# Altium schematic sheet SchematicArduinoUno.SchDoc: Basic Training
size A; DrawnBy: Carlos Berlin; Revision: Ver 1; SheetNumber: 2; SheetTotal: 2
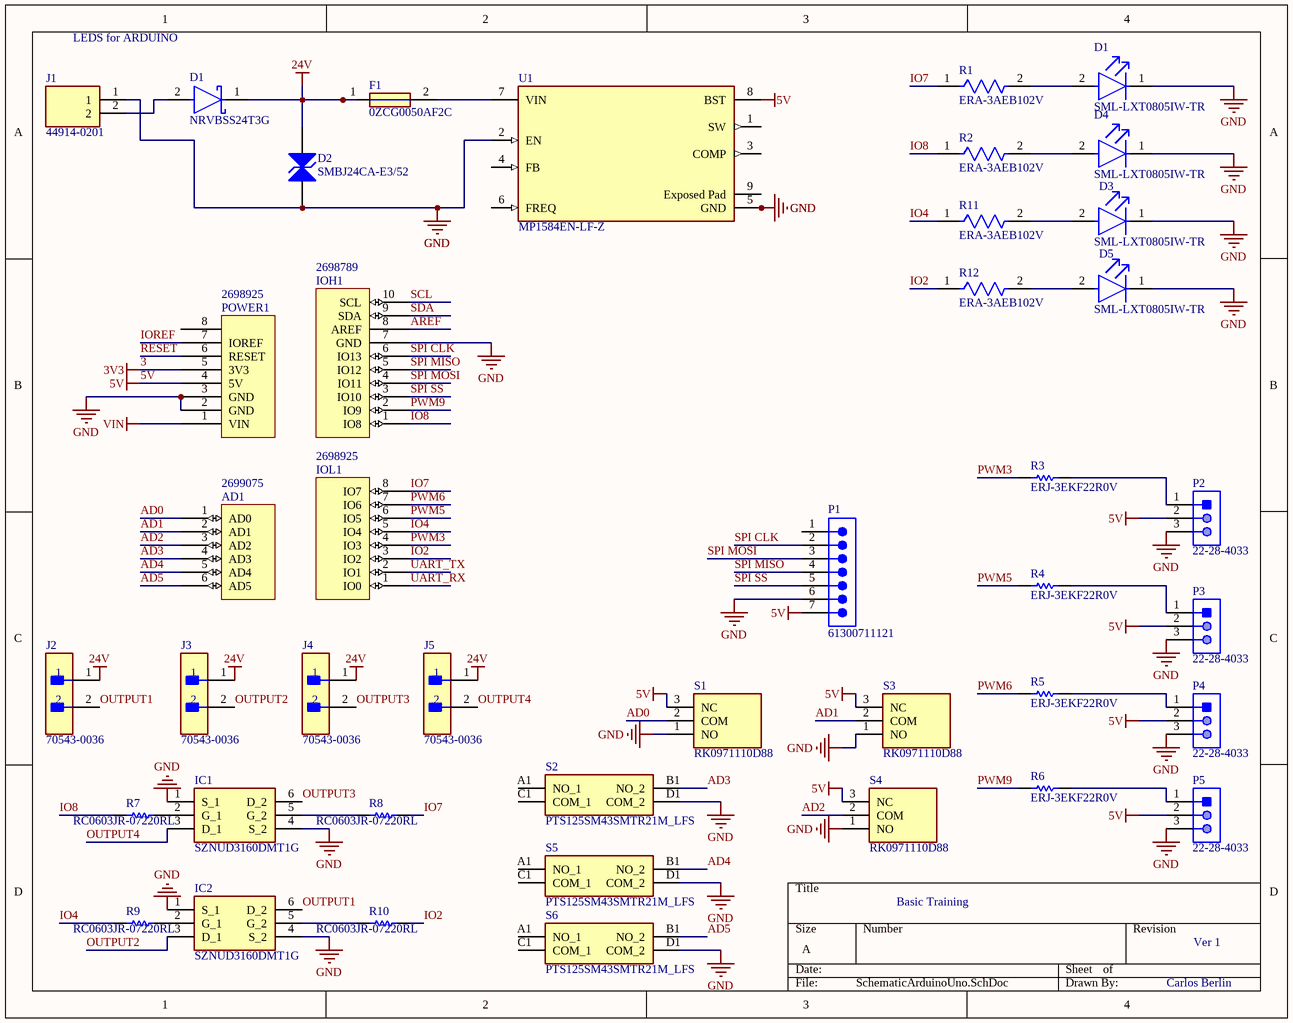
[diagram p0: SchematicArduinoUno.SchDoc]

## Parts
(Parts that share a designator on the sheet are numbered #1, #2 ... from top to bottom, then left to right.)
AD1  Supplier Part Number 4: 2699075  [Header 6x1 8.5mm]  (hidden comment: AD)
D1#1  SML-LXT0805IW-TR  [FP-SML-LXT0805IW-TR-MFG]
D1#2  NRVBSS24T3G  [FP-403A-03-MFG]
D2  SMBJ24CA-E3/52  [VISH-DO-214AA-A-2_V]
D3  SML-LXT0805IW-TR  [FP-SML-LXT0805IW-TR-MFG]
D4  SML-LXT0805IW-TR  [FP-SML-LXT0805IW-TR-MFG]
D5  SML-LXT0805IW-TR  [FP-SML-LXT0805IW-TR-MFG]
F1  0ZCG0050AF2C  [FUSC4632X75N]
IC1  SZNUD3160DMT1G  [SOT95P275X110-6N]
IC2  SZNUD3160DMT1G  [SOT95P275X110-6N]
IOH1  Supplier Part Number 3: 2698789  [Header 10x1 8.5mm]  (hidden comment: IOH)
IOL1  Supplier Part Number 4: 2698925  [Header 8x1 8.5mm]  (hidden comment: IOL)
J1  44914-0201  [44914-02YY_010203]
J2  70543-0036  [FP-70543-0036-MFG]
J3  70543-0036  [FP-70543-0036-MFG]
J4  70543-0036  [FP-70543-0036-MFG]
J5  70543-0036  [FP-70543-0036-MFG]
P1  61300711121  [61300711121]
P2  22-28-4033  [MOLX-22-28-4033_V]
P3  22-28-4033  [MOLX-22-28-4033_V]
P4  22-28-4033  [MOLX-22-28-4033_V]
P5  22-28-4033  [MOLX-22-28-4033_V]
POWER1  Supplier Part Number 4: 2698925  [Header 8x1 8.5mm]  (hidden comment: POWER_UNO)
R1  ERA-3AEB102V  [FP-ERA3A-IPC_C]
R2  ERA-3AEB102V  [FP-ERA3A-IPC_C]
R3  ERJ-3EKF22R0V  [RESC1608X55X30LL15T15]
R4  ERJ-3EKF22R0V  [RESC1608X55X30LL15T15]
R5  ERJ-3EKF22R0V  [RESC1608X55X30LL15T15]
R6  ERJ-3EKF22R0V  [RESC1608X55X30LL15T15]
R7  RC0603JR-07220RL  [RESC1608X55X25LL10T15]
R8  RC0603JR-07220RL  [RESC1608X55X25LL10T15]
R9  RC0603JR-07220RL  [RESC1608X55X25LL10T15]
R10  RC0603JR-07220RL  [RESC1608X55X25LL10T15]
R11  ERA-3AEB102V  [FP-ERA3A-IPC_C]
R12  ERA-3AEB102V  [FP-ERA3A-IPC_C]
S1  RK0971110D88  [RK0971110D88]
S2  PTS125SM43SMTR21M_LFS  [PTS125SM43SMTR21MLFS]
S3  RK0971110D88  [RK0971110D88]
S4  RK0971110D88  [RK0971110D88]
S5  PTS125SM43SMTR21M_LFS  [PTS125SM43SMTR21MLFS]
S6  PTS125SM43SMTR21M_LFS  [PTS125SM43SMTR21MLFS]
U1  MP1584EN-LF-Z  [FP-MP1584EN-LF-Z-MFG]

## Nets
3: POWER1.5(3V3)  [also labelled 3V3]
5V: P1.7 P2.2 P3.2 P4.2 P5.2 POWER1.4(5V) S1.3(NC) S3.3(NC) S4.3(NC) U1.8(BST)
24V: D1#2.1(C) D2.2(A) F1.1 J2.1 J3.1 J4.1 J5.1
GND: D1#1.1(C) D2.1(A) D3.1(C) D4.1(C) D5.1(C) IC1.1(S_1) IC1.4(S_2) IC2.1(S_1) IC2.4(S_2) IOH1.7(GND) J1.1 P1.6 P2.3 P3.3 P4.3 P5.3 POWER1.2(GND) POWER1.3(GND) S1.1(NO) S2.D1(COM_2) S3.1(NO) S4.1(NO) S5.D1(COM_2) S6.D1(COM_2) U1.2(EN) U1.5(GND)
VIN: POWER1.1(VIN)
AD0: AD1.1(AD0) S1.2(COM)
AD1: AD1.2(AD1) S3.2(COM)
AD2: AD1.3(AD2) S4.2(COM)
AD3: AD1.4(AD3) S2.B1(NO_2)
AD4: AD1.5(AD4) S5.B1(NO_2)
AD5: AD1.6(AD5) S6.B1(NO_2)
AREF: IOH1.8(AREF)
IO2: IOL1.3(IO2) R10.2 R12.1
IO4: IOL1.5(IO4) R9.1 R11.1
IO7: IOL1.8(IO7) R1.1 R8.2
IO8: IOH1.1(IO8) R2.1 R7.1
IOREF: POWER1.7(IOREF)
OUTPUT1: IC2.6(D_2) J2.2
OUTPUT2: IC2.3(D_1) J3.2
OUTPUT3: IC1.6(D_2) J4.2
OUTPUT4: IC1.3(D_1) J5.2
PWM3: IOL1.4(IO3) R3.1
PWM5: IOL1.6(IO5) R4.1
PWM6: IOL1.7(IO6) R5.1
PWM9: IOH1.2(IO9) R6.1
RESET: POWER1.6(RESET)
SCL: IOH1.10(SCL)
SDA: IOH1.9(SDA)
SPI CLK: IOH1.6(IO13) P1.2
SPI MISO: IOH1.5(IO12) P1.4
SPI MOSI: IOH1.4(IO11) P1.3
SPI SS: IOH1.3(IO10) P1.5
UART_RX: IOL1.1(IO0)
UART_TX: IOL1.2(IO1)
NetD1#1_2: D1#1.2(A) R1.2
NetD1#2_2: D1#2.2(A) J1.2
NetD3_2: D3.2(A) R11.2
NetD4_2: D4.2(A) R2.2
NetD5_2: D5.2(A) R12.2
NetF1_2: F1.2 U1.7(VIN)
NetIC1_2: IC1.2(G_1) R7.2
NetIC1_5: IC1.5(G_2) R8.1
NetIC2_2: IC2.2(G_1) R9.2
NetIC2_5: IC2.5(G_2) R10.1
NetP2_1: P2.1 R3.2
NetP3_1: P3.1 R4.2
NetP4_1: P4.1 R5.2
NetP5_1: P5.1 R6.2

Not connected (* = marked no-connect by the designer): P1 1; POWER1 8; S2 A1(NO_1) C1(COM_1); S5 A1(NO_1) C1(COM_1); S6 A1(NO_1) C1(COM_1); U1 1(SW) 3(COMP) 4(FB) 6(FREQ) 9(Exposed_Pad)

## Notes on the sheet
- LEDS for ARDUINO

## Library data of the parts
D1#1 D3-D5 = CMP-1724-00002-2: LED RED DIFFUSED SMD; Lens Style: Rectangular; Luminous Intensity: 11mcd; Approvals: UL; Test Current: 20mA; Forward Voltage: 2V; Number of LEDs: 1; Wavelength: 635nm; Lens Color: White; Viewing Angle: 140°; Min Operating Temperature: -25°C; Case Code (Metric): 2012; Mount: Surface Mount; Case Code (Imperial): 0805; Height: 0.8mm; Lead Free: Lead Free; Color: Red; Package Quantity: 1; Illumination Color: Red; Lens Transparency: Diffused; Forward Current: 20mA; Packaging: Tape and Reel; Length: 2mm; Case/Package: 0805; REACH SVHC: No SVHC; Width: 1.25mm; Number of Pins: 2; Max Operating Temperature: 80°C; Dominant Wavelength: 635nm
D1#2 = CMP-1055-00375-2: DIODE SCHOTTKY 40V 2A SMB; Max Reverse Current: 5.7mA; Max Forward Surge Current (Ifsm): 75A; Forward Voltage: 500mV; Element Configuration: Single; Package Quantity: 2500; Radiation Hardening: No; Packaging: Tape and Reel; Max Reverse Voltage (DC): 40V; Number of Pins: 2; Lead Free: Lead Free; Max Repetitive Reverse Voltage (Vrrm): 40V; Min Operating Temperature: -55°C; Forward Current: 2A; Average Rectified Current: 2A; RoHS Compliant: Yes; Case/Package: SMB; Peak Non-Repetitive Surge Current: 75A; Halogen Free: Halogen Free; Max Operating Temperature: 150°C
D2 = CMP-2000-07094-1: TRANSZORB(R) Transient Voltage Suppressor, 24 V, -55 to 150 degC, 2-Pin DO-214AA (SMBJ), RoHS, Tape and Reel; Manufacturer: Vishay; Clamping Voltage Vc Max: 38.9V; Peak Pulse Current Ippm: 14A; Product Range: TRANSZORBSMBJSeries; Power Dissipation Pd: 600W; Breakdown Voltage Min: 26.7V; No. of Pins: 2Pins; SVHC: ToBeAdvised; Breakdown Voltage Max: 29.5V; TVS Polarity: Bidirectional; Reverse Stand-Off Voltage Vrwm: 24V; Mounting Technology: SurfaceMount; Package Reference: DO-214AA; Package Description: 2-Pin Surface Mount Device, Body 4.315 x 3.62 mm; Diode Case Style: DO-214AA; Packaging: CutTape; Datasheet URL: http://www.vishay.com/docs/88392/smbj50a.pdf; Peak Pulse Power Dissipation: 600W; Manufacturer URL: http://www.vishay.com/; Datasheet Version: 02/2014
F1 = 0ZCG0050AF2C: Fuse; Manufacturer_Name: Bel; Datasheet Link: https://datasheet.datasheetarchive.com/originals/distributors/Datasheets-DGA6/522156.pdf; Height: 0.75mm; Manufacturer_Part_Number: 0ZCG0050AF2C; Mouser Part Number: 530-0ZCG0050AF2C
IC1 IC2 = SZNUD3160DMT1G: Integrated Circuit; Manufacturer_Name: onsemi; Datasheet Link: https://www.onsemi.com/pub/Collateral/NUD3160-D.PDF; Height: 1.1mm; Manufacturer_Part_Number: SZNUD3160DMT1G; Mouser Part Number: 863-SZNUD3160DMT1G; Mouser Price/Stock: https://www.mouser.co.uk/ProductDetail/onsemi/SZNUD3160DMT1G?qs=VZpK7o2ExSSaOj0toYUh%252BQ%3D%3D; Arrow Part Number: SZNUD3160DMT1G; Arrow Price/Stock: https://www.arrow.com/en/products/sznud3160dmt1g/on-semiconductor?region=nac
J1 = 44914-0201: Connector; Manufacturer_Name: Molex; Datasheet Link: https://www.molex.com/pdm_docs/sd/449140201_sd.pdf; Height: 9.91mm; Manufacturer_Part_Number: 44914-0201; Mouser Part Number: 538-44914-0201; Mouser Price/Stock: https://www.mouser.co.uk/ProductDetail/Molex/44914-0201?qs=c7kbnNtxOmhUyylJ0RNOdg%3D%3D
J2-J5 = CMP-04776-000427-1: CONN HEADER VERT 2POS 2.54MM; Gender: Male; Number of Contacts: 2; Voltage Rating (DC): 250V; Glow Wire Compliant: Non-compliant; Contact Resistance: 30mR; Current Rating: 3A; Series: 70543; Color: Black; Packaging: Rail/Tube; RoHS Compliant: Yes; Pitch: 2.54mm; Housing Material: Thermoplastic; Contact Material: Bronze; Material: Brass; Min Operating Temperature: -40°C; ELV: Compliant; Radiation Hardening: No; Orientation: Vertical; Flammability Rating: UL94 V-0; Termination: Through Hole; Package Quantity: 3456; Max Operating Temperature: 105°C; Contact Gender: Male; Lead Free: Contains Lead; Voltage Rating: 250V; Number of Positions: 2; Mount: Through Hole; Contact Plating: Tin; Number of Rows: 1; Housing Color: Black; Number of Circuits: 2
P1 = CMP-1502-01074-3: NexarPartId: 32855531; Current Rating: 3A; Number of Positions: 7; Connector Type: Male Pin; Gender: Male; Operating Supply Voltage: 250V; Pitch: 2.54mm; Contact Resistance: 20mΩ; Contact Material: Copper; Contact Plating: Gold; Contact Mating Length: 5.9944mm; Mount: Through Hole; Termination: Solder; Number of Pins: 7; Color: Black; Packaging: Bulk; REACH SVHC: Unknown; Orientation: Vertical; Lead Pitch: 2.54mm; RoHS: Compliant; Number of Rows: 1; Number of Contacts: 7
P2-P5 = CMP-1676-00001-5: Male Header, Pitch 2.54 mm, 1 x 3 Position, Height 8.38 mm, Tail Length 3.18 mm, RoHS, Bulk; Manufacturer: Molex; Rows: 1; Voltage Rating: 250 V; Current Rating: 4 A; Min Operating Temperature: 0 degC; Lead Pitch: 0.1 inch; Packaging: Bulk; Contact Finish: Gold; RoHSCompliant: true; Contact Material: Brass; PackageReference: 22-28-4033; REACH SVHC: Unknown; PackageDescription: Male Header, Pitch 2.54 mm, 1 x 3 Position, Height 8.38 mm, Tail Length 3.18 mm; ComponentLink2URL: http://www.molex.com/pdm_docs/sd/022284033_sd.pdf; Height: 8.38 mm; Mounting Technology: Through Hole; ComponentLink1Description: Manufacturer URL; Length: 7.62 mm; Mount: Through Hole; DatasheetVersion: Rev. G, 01/2012; Max Operating Temperature: 75 degC; ComponentLink2Description: Datasheet; Colour: Black; Pins: 3; Contact Plating: Gold; Package Quantity: 1; ComponentLink1URL: http://www.molex.com/
R1 R2 R11 R12 = CMP-2000-00873-2: RES SMD 1K OHM 0.1% 1/10W 0603; Temperature Coefficient: 25ppm/°C; Voltage Rating: 75V; Max Power Dissipation: 100mW; Resistance: 1kR; Technology: METAL FILM; Number of Pins: 2; Packaging: Tape and Reel; Case Code (Imperial): 0603; Case Code (Metric): 1608; Min Operating Temperature: -55°C; REACH SVHC: No SVHC; Length: 1.6mm; Termination: SMD/SMT; Depth: 0.8mm; Resistance Tolerance: 0.1%; Number of Terminations: 2; Width: 0.8mm; Military Standard: Not; Tolerance: 0.1%; Package Quantity: 5000; Contact Plating: Tin; Height: 0.45mm; Construction: Rectangular; Case/Package: 0603; Max Operating Temperature: 155°C; Resistor Type: Thin Film; Series: ERA-3A; Size Code: 0603; RoHS Compliant: Yes; Mount: Surface Mount; Radiation Hardening: No; Power Rating: 100mW
R3-R6 = CMP-1012-00320-3: Chip Resistor, 22 Ohm, +/- 1%, 0.1 W, -55 to 155 degC, 0603 (1608 Metric), RoHS, Tape and Reel; PackageReference: 0603; ComponentLink2URL: http://industrial.panasonic.com/cdbs/www-data/pdf/RDA0000/AOA0000C86.pdf; ComponentLink2Description: Datasheet; PackageDescription: 2-Pin Surface Mount Device, Body 1.6 x 0.85 mm; ComponentLink1URL: http://www.panasonic.com/; ComponentLink1Description: Manufacturer URL; DatasheetVersion: Apr-15
R7-R10 = CMP-1012-00058-2: Chip Resistor, 220 Ohm, +/- 5%, 0.1 W, -55 to 155 degC, 0603 (1608 Metric), RoHS, Tape and Reel; Manufacturer: Yageo; Temperature Coefficient: 100PPM/C; Voltage Rating: 50V; Resistance: 220Ohms; Power Rating: 100mW; Mounting Technology: SurfaceMount; Tolerance: 5%; Datasheet URL: http://www.yageo.com/documents/recent/PYu-RC_Group_51_RoHS_L_7.pdf; Operating Temperature Range: -55Cto+155C; Packaging: Reel; Package Description: 2-Pin Surface Mount Device, Body 1.6 x 0.8 mm; Termination Style: SMD/SMT; Datasheet Version: Rev. 7, 05/2017; Product: ThickFilmResistorsGeneralPurpose; Package Reference: 0603; Case Code - in: 0603; Manufacturer URL: http://www.yageo.com/; Case Code - mm: 1608; Series: RC
S1 S3 S4 = RK0971110D88: Switch; Manufacturer_Name: ALPS Electric; Datasheet Link: https://componentsearchengine.com/Datasheets/1/RK0971110D88.pdf; Height: 11.35mm; Manufacturer_Part_Number: RK0971110D88; Mouser Part Number: 688-RK0971110D88; Mouser Price/Stock: https://www.mouser.co.uk/ProductDetail/Alps-Alpine/RK0971110D88?qs=fQ8kcZGzY5UAUZFVVHulew%3D%3D
S2 S5 S6 = PTS125SM43SMTR21M_LFS: Switch; Manufacturer_Name: C & K COMPONENTS; Manufacturer_Part_Number: PTS125SM43SMTR21M LFS; Datasheet Link: https://www.ckswitches.com/media/1462/pts125.pdf; Height: 4.3mm; Mouser Part Number: 611-PTS125S43SMTRLFS; Mouser Price/Stock: https://www.mouser.co.uk/ProductDetail/CK/PTS125SM43SMTR21M-LFS?qs=t7xnP681wgUNXpRGJY2Vkw%3D%3D
U1 = CMP-57379-000006-1: IC REG BUCK ADJ 3A; Manufacturer: Monolithic Power Systems; Output Type: AdjustableProgrammable; Nominal Supply Current: 100uA; Switching Frequency: 100-1500kHz; Max Power Dissipation: 2.5W; Output Voltage: 0.8-25V; Max Junction Temp: +125°C; Min Supply Voltage: 4.5V; Max Supply Voltage: 28V; Number Of Outputs: 1; Standoff Height: 0mm; ComponentLink2URL: https://www.monolithicpower.com/en/documentview/productdocument/index/doc_url/L01QMTU4NF9yMS4wLnBkZg%3D%3D/release_date/MjAwOS0wNC0wOSAwMDowMDowMA%3D%3D/; Lead Free: Yes; Package: MP1584EN-LF-Z; Temperature Range Low: -20°C; Temperature: -20°C to +125°C; Height: 1.7mm; Ambient Temperature Range Low: -20°C; RoHS: TRUE; Automotive: No; Ipc Land Pattern Name: SOIC127P600X150-8; Ambient Temperature Range High: +85°C; Device Class L2: Power Management ICs; ComponentLink2Description: Datasheet; Manufacturer Part Number: MP1584EN-LF-Z; Device Class L3: Voltage Regulators - Switching; Octopart: https://octopart.com/mp1584en-lf-z-monolithic+power+systems-18629680; Category: IC; Output Current: 3A; Digikey Description: IC REG BUCK ADJ 3A; Temperature Range High: +125°C; Device Class L1: Integrated Circuits (ICs); Switching Topology: Buck
AD1 = AD: Supplier 1: Arrow; Supplier Part Number 1: 2699089; Supplier 2: Digi-Key; Supplier Part Number 2: SAM1198-06-ND; Supplier 3: Arrow; Supplier Part Number 3: 2699088; Supplier 4: Arrow
IOH1 = IOH: Supplier 1: Arrow; Supplier Part Number 1: 2698803S4475693N1004; Supplier 2: Digi-Key; Supplier Part Number 2: SAM1198-10-ND; Supplier 3: Arrow
IOL1 = IOL: Supplier 1: Digi-Key; Supplier Part Number 1: SAM1198-08-ND; Supplier 2: Arrow; Supplier Part Number 2: 2698939; Supplier 3: Arrow; Supplier Part Number 3: 2698940; Supplier 4: Arrow
POWER1 = POWER_UNO: Supplier 1: Digi-Key; Supplier Part Number 1: SAM1198-08-ND; Supplier 2: Arrow; Supplier Part Number 2: 2698939; Supplier 3: Arrow; Supplier Part Number 3: 2698940; Supplier 4: Arrow